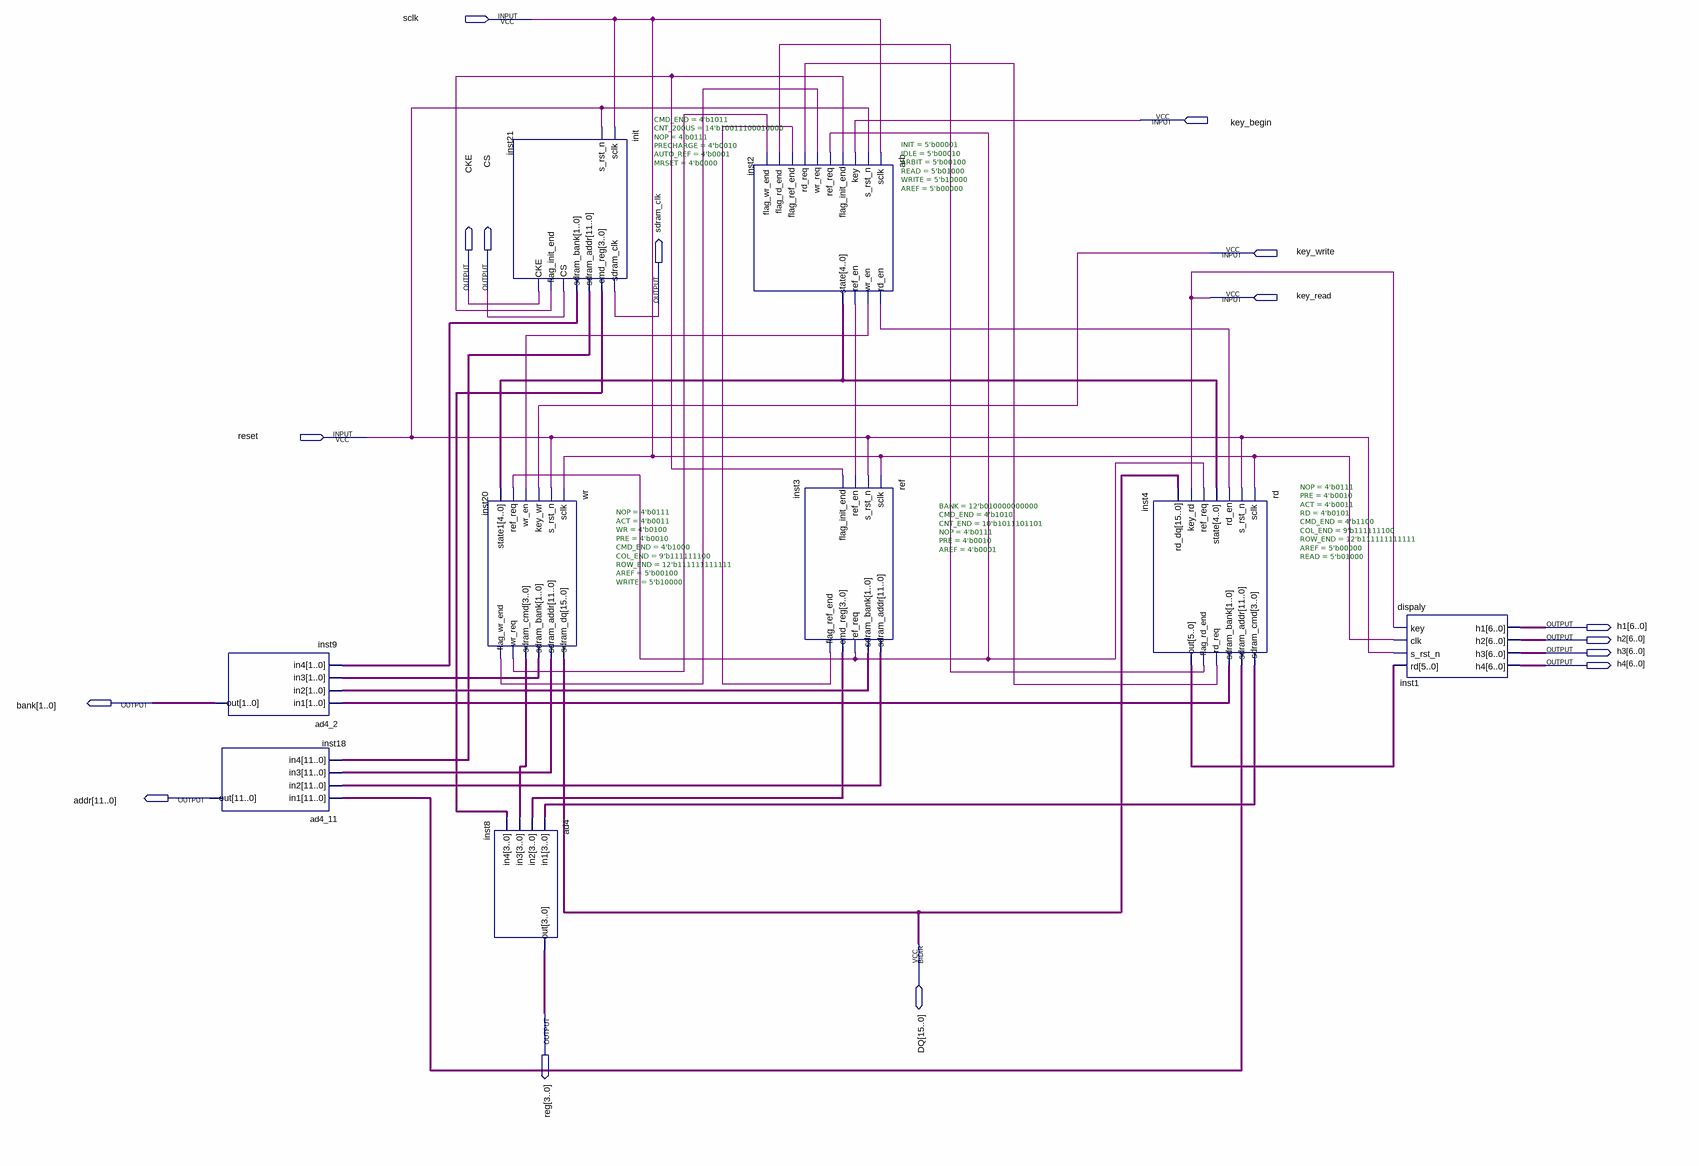
[diagram p0: schematic sheet]
// Quartus schematic top.bdf as structural Verilog: 9 symbols, 16 pins
module top (
  input  sclk,
  input  key_begin,
  input  key_write,
  input  key_read,
  input  reset,
  inout  [15:0] DQ,
  output CKE,
  output CS,
  output sdram_clk,
  output [6:0] h1,
  output [6:0] h2,
  output [6:0] h3,
  output [6:0] h4,
  output [1:0] bank,
  output [11:0] addr,
  output [3:0] \reg 
);

  wire inst2_rd_en, inst2_ref_en, inst2_wr_en, inst3_flag_ref_end, inst3_ref_req, inst4_flag_rd_end,
       inst4_rd_req, inst20_flag_wr_end, inst20_wr_req, inst21_flag_init_end;
  wire [1:0] inst3_sdram_bank, inst4_sdram_bank, inst20_sdram_bank, inst21_sdram_bank;
  wire [3:0] inst3_cmd_reg, inst4_sdram_cmd, inst20_sdram_cmd, inst21_cmd_reg;
  wire [4:0] inst2_state;
  wire [5:0] inst4_out;
  wire [11:0] inst3_sdram_addr, inst4_sdram_addr, inst20_sdram_addr, inst21_sdram_addr;

  ad4_2 inst9 (
    .in1(inst4_sdram_bank), .in2(inst3_sdram_bank), .in3(inst20_sdram_bank), .in4(inst21_sdram_bank),
    .out(bank));
  ad4_11 inst18 (
    .in1(inst4_sdram_addr), .in2(inst3_sdram_addr), .in3(inst20_sdram_addr), .in4(inst21_sdram_addr),
    .out(addr));
  wr #(.NOP(4'b0111), .ACT(4'b0011), .WR(4'b0100), .PRE(4'b0010), .CMD_END(4'b1000), .COL_END(9'b111111100), .ROW_END(12'b111111111111), .AREF(5'b00100), .WRITE(5'b10000)) inst20 (
    .sclk(sclk), .s_rst_n(reset), .key_wr(key_write), .wr_en(inst2_wr_en), .ref_req(inst3_ref_req),
    .state1(inst2_state), .sdram_dq(DQ), .sdram_addr(inst20_sdram_addr), .sdram_bank(inst20_sdram_bank),
    .sdram_cmd(inst20_sdram_cmd), .wr_req(inst20_wr_req), .flag_wr_end(inst20_flag_wr_end));
  ad4 inst8 (.in1(inst4_sdram_cmd), .in2(inst3_cmd_reg), .in3(inst20_sdram_cmd), .in4(inst21_cmd_reg), .out(\reg ));
  init #(.CMD_END(4'b1011), .CNT_200US(14'b10011100010000), .NOP(4'b0111), .PRECHARGE(4'b0010), .AUTO_REF(4'b0001), .MRSET(4'b0000)) inst21 (
    .sclk(sclk), .s_rst_n(reset), .sdram_clk(sdram_clk), .cmd_reg(inst21_cmd_reg),
    .sdram_addr(inst21_sdram_addr), .sdram_bank(inst21_sdram_bank), .CS(CS),
    .flag_init_end(inst21_flag_init_end), .CKE(CKE));
  arb #(.INIT(5'b00001), .IDLE(5'b00010), .ARBIT(5'b00100), .READ(5'b01000), .WRITE(5'b10000), .AREF(5'b00000)) inst2 (
    .sclk(sclk), .s_rst_n(reset), .key(key_begin), .flag_init_end(inst21_flag_init_end),
    .ref_req(inst3_ref_req), .wr_req(inst20_flag_wr_end), .rd_req(inst4_rd_req),
    .flag_ref_end(inst3_flag_ref_end), .flag_rd_end(inst4_flag_rd_end), .flag_wr_end(inst20_wr_req),
    .rd_en(inst2_rd_en), .wr_en(inst2_wr_en), .ref_en(inst2_ref_en), .state(inst2_state));
  \ref  #(.BANK(12'b010000000000), .CMD_END(4'b1010), .CNT_END(10'b1011101101), .NOP(4'b0111), .PRE(4'b0010), .AREF(4'b0001)) inst3 (
    .sclk(sclk), .s_rst_n(reset), .ref_en(inst2_ref_en), .flag_init_end(inst21_flag_init_end),
    .sdram_addr(inst3_sdram_addr), .sdram_bank(inst3_sdram_bank), .ref_req(inst3_ref_req),
    .cmd_reg(inst3_cmd_reg), .flag_ref_end(inst3_flag_ref_end));
  rd #(.NOP(4'b0111), .PRE(4'b0010), .ACT(4'b0011), .RD(4'b0101), .CMD_END(4'b1100), .COL_END(9'b111111100), .ROW_END(12'b111111111111), .AREF(5'b00000), .READ(5'b01000)) inst4 (
    .sclk(sclk), .s_rst_n(reset), .rd_en(inst2_rd_en), .state(inst2_state), .ref_req(inst3_ref_req),
    .key_rd(key_read), .rd_dq(DQ), .sdram_cmd(inst4_sdram_cmd), .sdram_addr(inst4_sdram_addr),
    .sdram_bank(inst4_sdram_bank), .rd_req(inst4_rd_req), .flag_rd_end(inst4_flag_rd_end), .out(inst4_out));
  dispaly inst1 (.key(key_read), .clk(sclk), .s_rst_n(reset), .rd(inst4_out), .h1(h1), .h2(h2), .h3(h3), .h4(h4));
endmodule
